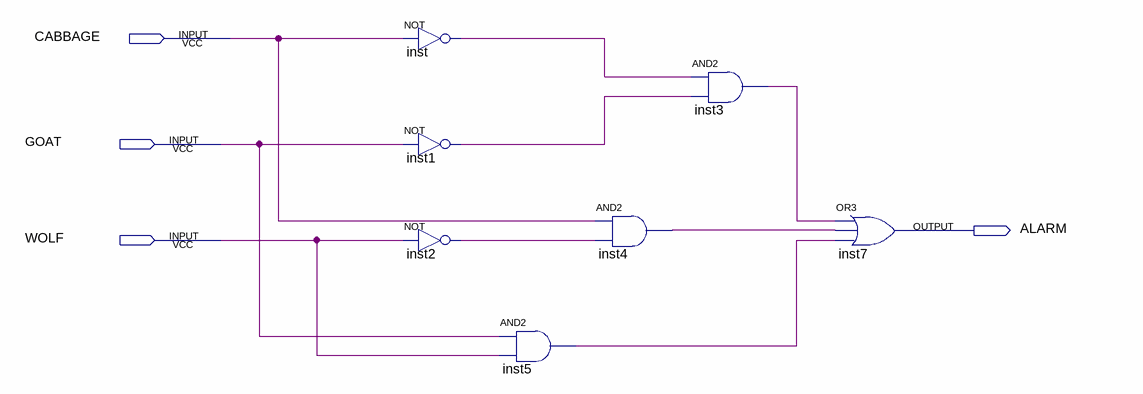
[diagram p0: schematic sheet]
// Quartus schematic lab2step2.bdf as structural Verilog: 7 symbols, 4 pins
module lab2step2 (
  input  CABBAGE,
  input  GOAT,
  input  WOLF,
  output ALARM
);

  wire inst1_out, inst2_out, inst3_out, inst4_out, inst5_out, inst_out;

  not inst (inst_out, CABBAGE);
  not inst1 (inst1_out, GOAT);
  not inst2 (inst2_out, WOLF);
  and inst5 (inst5_out, GOAT, WOLF);
  and inst4 (inst4_out, CABBAGE, inst2_out);
  and inst3 (inst3_out, inst_out, inst1_out);
  or inst7 (ALARM, inst3_out, inst4_out, inst5_out);
endmodule
